# Altium schematic sheet Cell.SchDoc
size 152 x 88 mm
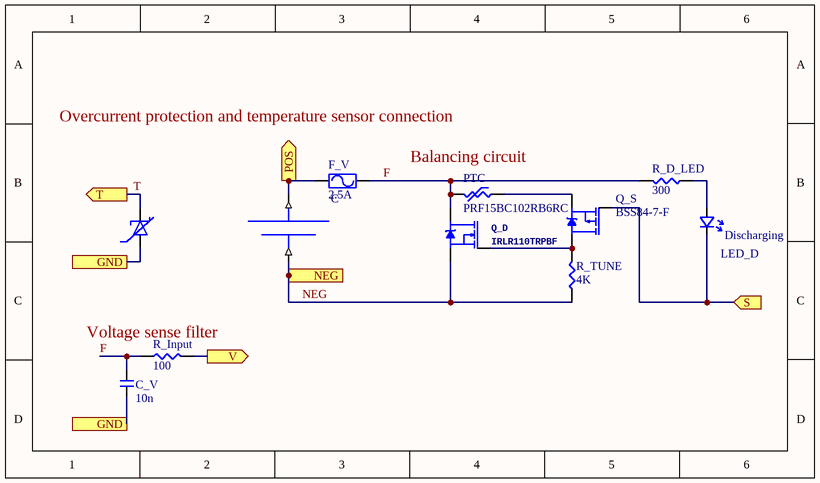
[diagram p0: Cell.SchDoc]

## Parts
C  Li1x7pVTC6T with Clip Mounts  [Li1x7pVTC6T_Clips]  (value not drawn)
C_V  10n  [CAP-0603]
F_V  2.5A  [FUSE1206]
LED_D  Discharging  [LED-0603]
PTC  PRF15BC102RB6RC  [NTC-0603]
Q_D  IRLR110TRPBF  [TO252]
Q_S  BSS84-7-F  [SOT23]
R_D_LED  300  [RES-0603]
R_Input  100  [RES-0603]
R_TUNE  4K  [RES-0603]

## Ports
GND, NEG (in), POS (out), S (in), T (out), V (out)

## Nets
F: C_V.2 F_V.2 PTC.2 Q_D.2(D) R_D_LED.2 R_Input.1
GND: C.T- C_V.1 ; port GND
NEG: C.- Q_D.3(S) R_TUNE.1 ; port NEG
POS: C.+ F_V.1 ; port POS
S: LED_D.K Q_S.1(G) ; port S
T: C.T+ ; port T
V: R_Input.2 ; port V
NetLED_D_A: LED_D.A R_D_LED.1
NetPTC_1: PTC.1 Q_S.2(S)
NetQ_D_1: Q_D.1(G) Q_S.3(D) R_TUNE.2

## Notes on the sheet
- Overcurrent protection and temperature sensor connection
- Balancing circuit
- (near R_Input) Voltage sense filter

## Library data of the parts
C = Li1x7pVTC6T_Clip
C_V = CAP-0603
F_V = FUSE-1206
LED_D = LED-0603
PTC = NTC-0603
Q_D = NMOS-TO252: GateName_1: G$1; SymbolName_1: LABELED-PMOS; DeviceSetName: DMP10H400SK3-13; LibraryName: IFE_Transistors; Package: TO252
Q_S = PMOS-SOT23
R_D_LED R_Input R_TUNE = RES-0603